# EAGLE schematic TwistIt (EAGLE 9.1.0)
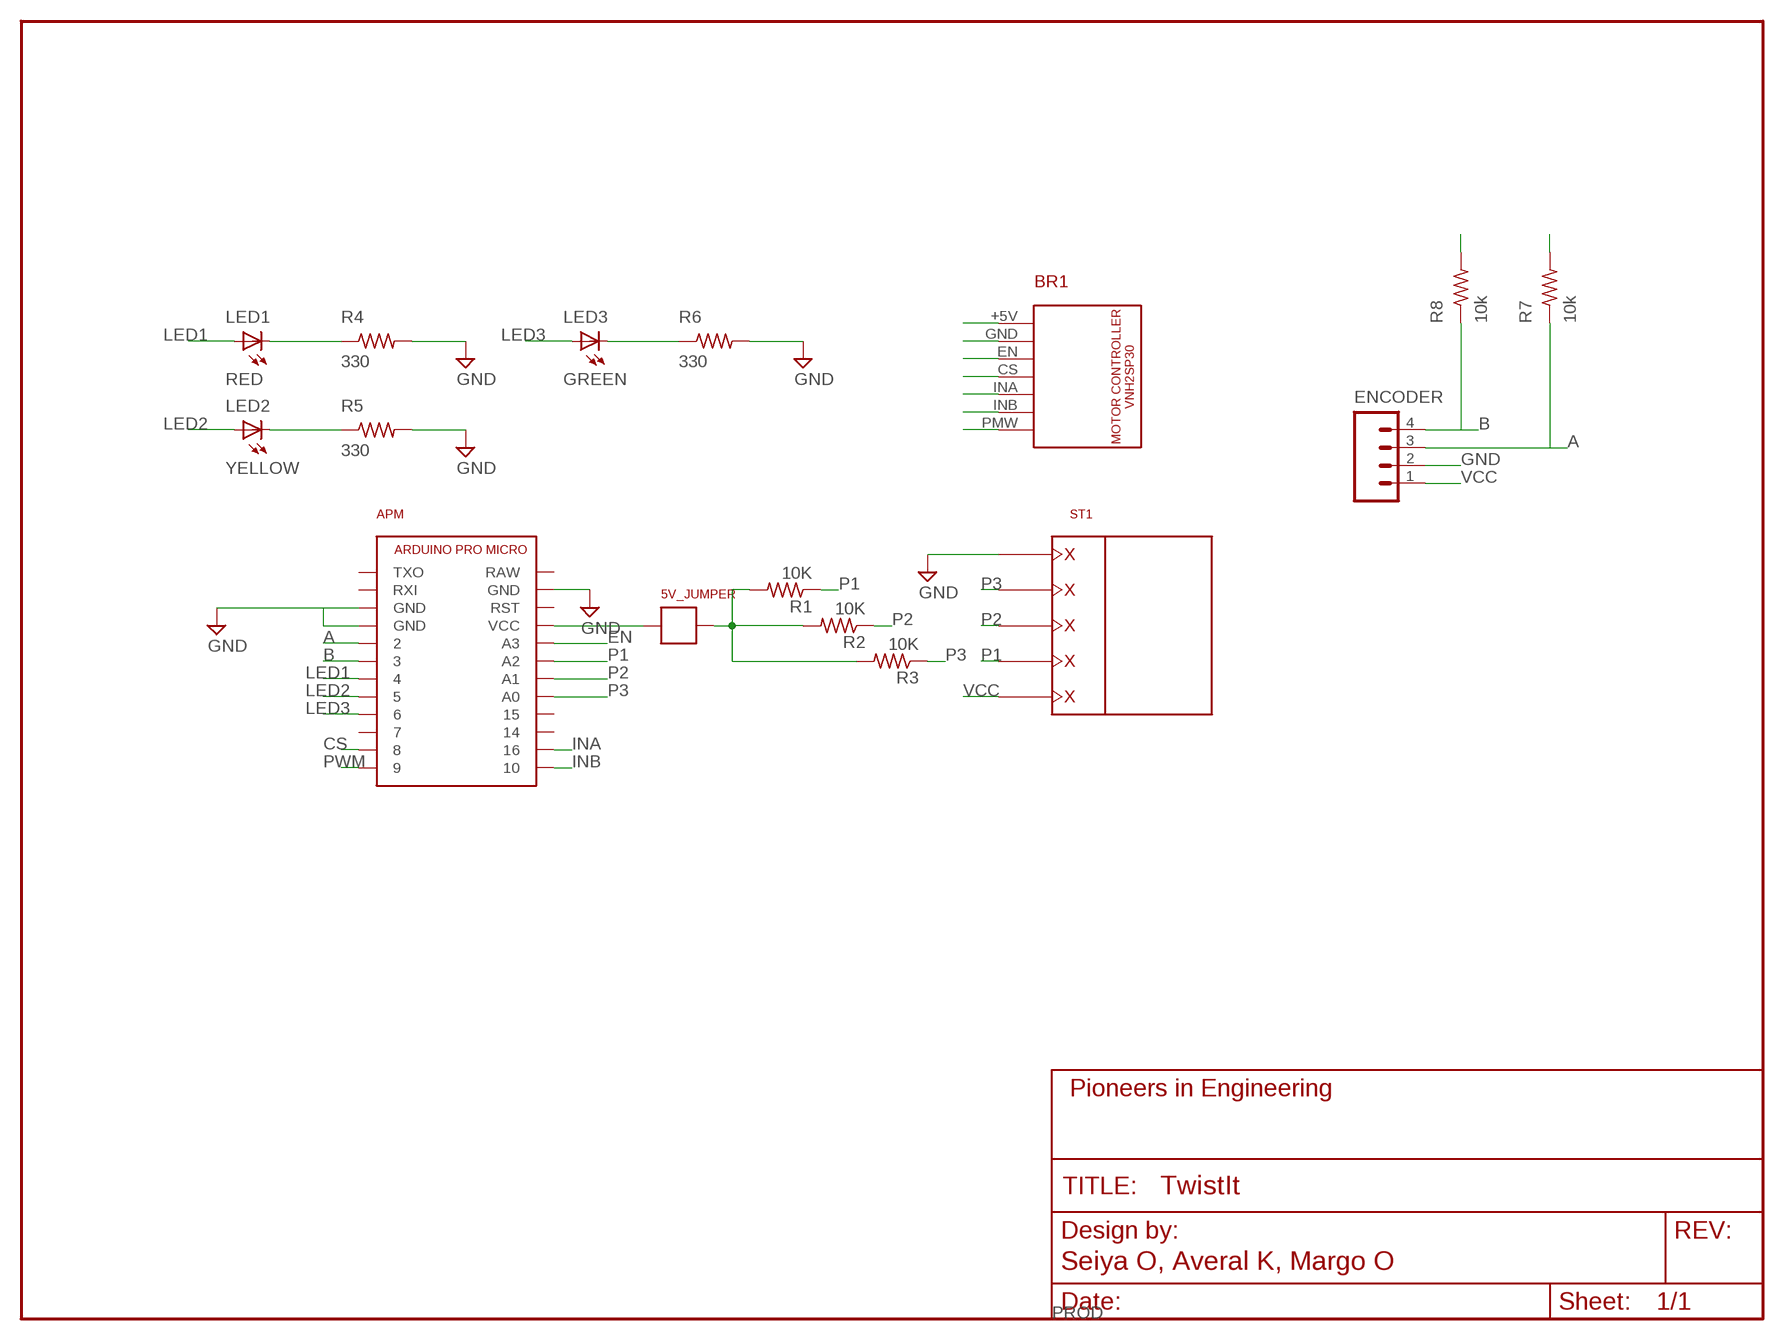
[diagram p0: schematic, sheet 1]
FRAME1 (FRAME_SCHEMATIC): AUTHOR: Seiya O, Averal K, Margo O; REVISION: PROD

## Parts
5V_JUMPER  JUMPER  [JUMPER]
APM  ARDUINO_PRO_MICRO  [ARDUINO_PRO_MICRO]
BR1  VNH2SP30_MOTOR_CONTROLLER  [VNH2SP30_MOTOR_CONTROLLER]
ENCODER  M041X04-MTA  [1X04-MTA]
LED1  RED  LED1206  [LED-1206]
LED2  YELLOW  LED1206  [LED-1206]
LED3  GREEN  LED1206  [LED-1206]
R1  10K  R-US_R0603  [R0603]
R2  10K  R-US_R0603  [R0603]
R3  10K  R-US_R0603  [R0603]
R4  330  R-US_R0603  [R0603]
R5  330  R-US_R0603  [R0603]
R6  330  R-US_R0603  [R0603]
R7  10k  R-US_R0603  [R0603]
R8  10k  R-US_R0603  [R0603]
ST1  5PIN_SCREW  [5PIN_SCREW]

## Nets
5V: 5V_JUMPER.P$2 R1.2 R2.2 R3.2
A: APM.2 ENCODER.3 R7.1
B: APM.3 ENCODER.4 R8.1
CS: APM.8 BR1.CS
EN: APM.A3 BR1.EN
GND: APM.GND@0(GND) APM.GND@1(GND) APM.GND@2(GND) BR1.GND ENCODER.2 R4.2 R5.2 R6.2 ST1.P$1
INA: APM.16 BR1.INA
INB: APM.10 BR1.INB
LED1: APM.4 LED1.A
LED2: APM.5 LED2.A
LED3: APM.6 LED3.A
N$2: LED1.C R4.1
N$4: LED2.C R5.1
N$6: LED3.C R6.1
P1: APM.A2 R1.1 ST1.P$4
P2: APM.A1 R2.1 ST1.P$3
P3: APM.A0 R3.1 ST1.P$2
PWM: APM.9 BR1.PMW(PWM)
VCC: 5V_JUMPER.P$1 APM.VCC BR1.+5V ENCODER.1 R7.2 R8.2 ST1.P$5
Unconnected: APM.7 APM.14 APM.15 APM.RAW APM.RST APM.RXI APM.TXO

## Library data of the parts
5V_JUMPER = pie:JUMPER: 2 Pin Jumper; DESCRIPTION: JUMPER; DISTRIBUTOR: DigiKey; DISTRIBUTOR_PART_NUMBER: 952-2262-ND; MANUFACTURER: Harwin. Inc; MANUFACTURER_PART_NUMBER: M20-9990246; PACKAGE: JP
APM = pie:ARDUINO_PRO_MICRO: Arduino Pro Micro Electrical System Year 9's Smart Sensor Core Pin Outs <https://cdn.sparkfun.com/assets/9/c/3/c/4/523a1765757b7f5c6e8b4567.png> Buy Here <http://www.aliexpress.com/item/Mini-Leonardo-Pro-Micro-ATmega32U4-5V-16MHz-Module-For-Arduino-Best-Quality/32284746884.html?ws_ab_test=searchweb201556_8,searchweb201602_2_10057_10056_10065_10055_10054_10067_10069_10059_10058_10017_10070_10060_10061_10052_10062_10053_10050_10051,searchweb201603_1&btsid=45993952-29ca-4de4-a0fb-c7fb72b8e1a5> Thru Hole Female Pins <http://www.digikey.com/product-search/en?keywords=929974E-01-12-ND> Surface Mount Female Pins <http://www.digikey.com/product-detail/en/sullins-connector-solutions/NPTC121KFXC-RC/S5604-ND/776062>; DESCRIPTION: Arduino Pro Micro; DISTRIBUTOR: AliExpress; DISTRIBUTOR_PART_NUMBER: 32284746884; MANUFACTURER: Feiyang electronics; NOTES: https://www.aliexpress.com/item/Mini-Leonardo-Pro-Micro-ATmega32U4-5V-16MHz-Module-For-Arduino-Best-Quality/32284746884.html?ws_ab_test=searchweb201556_8,searchweb201602_2_10057_10056_10065_10055_10054_10067_10069_10059_10058_10017_10070_10060_10061_10052_10062_10053_10050_10051,searchweb201603_1&btsid=45993952-29ca-4de4-a0fb-c7fb72b8e1a5; PACKAGE: ARDUINO_PRO_MICRO; REFERENCE_DEST: ARDUINO_PRO_MICRO
BR1 = pie:VNH2SP30_MOTOR_CONTROLLER: VNH2SP30 MOTOR CONTROLLER
ENCODER = pie:M04: 4-pin 0.1-inch header and MTA connector; PIE-INT-REF-NUM: MTA
LED1-LED3 = pie:LED: LEDs Standard schematic elements and footprints for 5mm, 3mm, 1206, and 0603 sized LEDs. 5mm - Spark Fun Electronics SKU : COM-00529 (and others); PIE-INT-REF-NUM: LED
R1-R3 = resistor:R-US_: RESISTOR, American symbol
R4-R8 = pie:R-US_: RESISTOR, American symbol; DESCRIPTION: RESISTOR, American symbol; DISTRIBUTOR: DigiKey; MANUFACTURER: Rohm Semiconductor; NOTES: Cut Tape; PACKAGE: R0603; VALUE: >VALUE
ST1 = pie:5PIN_SCREW: 5 Pin Screw Terminal Sparkfun Page <https://www.sparkfun.com/products/8432> 5mm Pitch The 2 and 3 Pins Screw Terminals can be linked together seamlessly.; DESCRIPTION: 5 pin Screw Terminal; DISTRIBUTOR: DigiKey; DISTRIBUTOR_PART_NUMBER: 277-1239-ND; MANUFACTURER: Phoenix Contact; MANUFACTURER_PART_NUMBER: 1729047; PACKAGE: 5PIN_SCREW